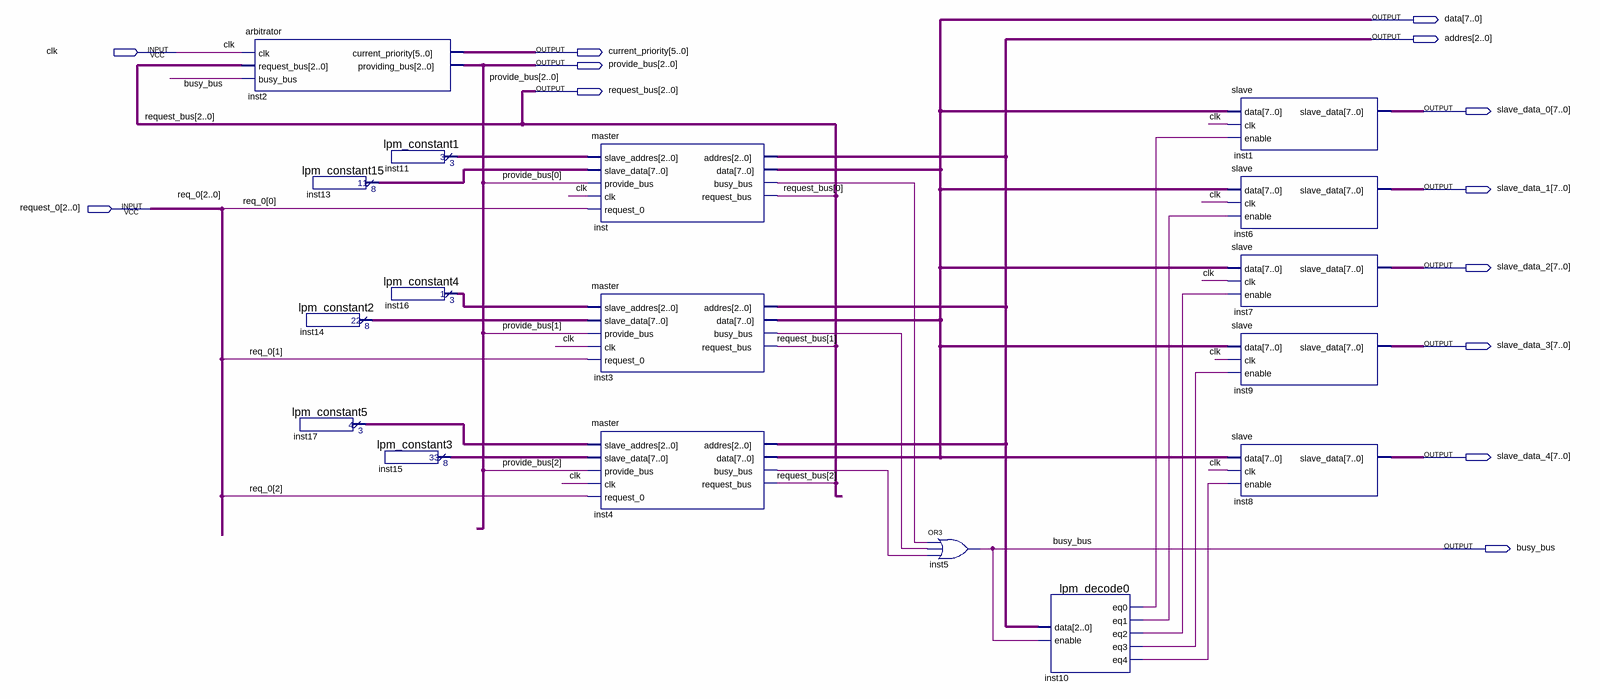
[diagram p0: schematic sheet]
// Quartus schematic lab1.bdf as structural Verilog: 17 symbols, 13 pins
module lab1 (
  input  clk,
  input  [2:0] request_0,
  output [7:0] data,
  output [2:0] addres,
  output [5:0] current_priority,
  output [2:0] provide_bus,
  output [2:0] request_bus,
  output [7:0] slave_data_0,
  output [7:0] slave_data_1,
  output [7:0] slave_data_2,
  output [7:0] slave_data_3,
  output [7:0] slave_data_4,
  output busy_bus
);

  wire inst3_busy_bus, inst4_busy_bus, inst10_eq0, inst10_eq1, inst10_eq2, inst10_eq3, inst10_eq4,
       inst_busy_bus;
  wire [2:0] inst11_result, inst16_result, inst17_result;
  wire [7:0] inst13_result, inst14_result, inst15_result;

  arbitrator inst2 (
    .clk(clk), .request_bus(request_bus), .busy_bus(busy_bus), .current_priority(current_priority),
    .providing_bus(provide_bus));
  lpm_constant15 inst13 (.result(inst13_result));
  lpm_constant2 inst14 (.result(inst14_result));
  lpm_constant5 inst17 (.result(inst17_result));
  lpm_constant1 inst11 (.result(inst11_result));
  lpm_constant4 inst16 (.result(inst16_result));
  lpm_constant3 inst15 (.result(inst15_result));
  master inst (
    .slave_addres(inst11_result), .slave_data(inst13_result), .provide_bus(provide_bus[0]), .clk(clk),
    .request_0(request_0[0]), .addres(addres), .data(data), .busy_bus(inst_busy_bus),
    .request_bus(request_bus[0]));
  master inst3 (
    .slave_addres(inst16_result), .slave_data(inst14_result), .provide_bus(provide_bus[1]), .clk(clk),
    .request_0(request_0[1]), .addres(addres), .data(data), .busy_bus(inst3_busy_bus),
    .request_bus(request_bus[1]));
  master inst4 (
    .slave_addres(inst17_result), .slave_data(inst15_result), .provide_bus(provide_bus[2]), .clk(clk),
    .request_0(request_0[2]), .addres(addres), .data(data), .busy_bus(inst4_busy_bus),
    .request_bus(request_bus[2]));
  or inst5 (busy_bus, inst_busy_bus, inst3_busy_bus, inst4_busy_bus);
  lpm_decode0 inst10 (
    .data(addres), .enable(busy_bus), .eq0(inst10_eq0), .eq1(inst10_eq1), .eq2(inst10_eq2), .eq3(inst10_eq3),
    .eq4(inst10_eq4));
  slave inst1 (.data(data), .clk(clk), .enable(inst10_eq0), .slave_data(slave_data_0));
  slave inst6 (.data(data), .clk(clk), .enable(inst10_eq1), .slave_data(slave_data_1));
  slave inst7 (.data(data), .clk(clk), .enable(inst10_eq2), .slave_data(slave_data_2));
  slave inst9 (.data(data), .clk(clk), .enable(inst10_eq3), .slave_data(slave_data_3));
  slave inst8 (.data(data), .clk(clk), .enable(inst10_eq4), .slave_data(slave_data_4));

  // Other names for the same wires on the sheet: req_0[2:0] = request_0
endmodule
